# Altium schematic sheet ET-GCLK.SchDoc
size A4
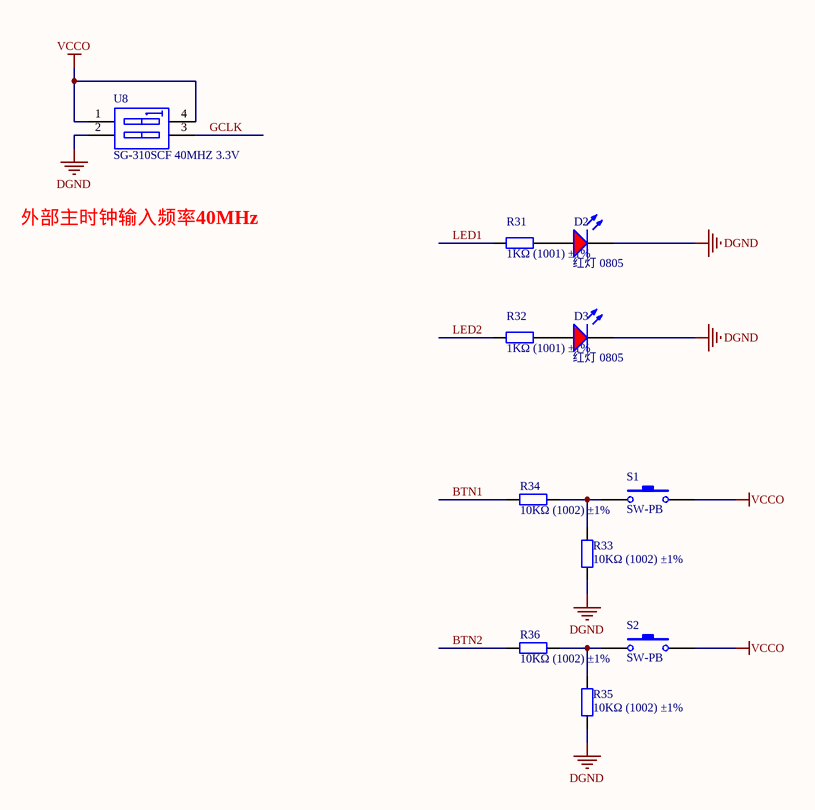
[diagram p0: ET-GCLK.SchDoc]

## Parts
D2  红灯 0805  [LC-0805_LED_S1]
D3  红灯 0805  [LC-0805_LED_S1]
R31  1KΩ (1001) ±1%  [LC-0805_R]
R32  1KΩ (1001) ±1%  [LC-0805_R]
R33  10KΩ (1002) ±1%  [LC-0805_R]
R34  10KΩ (1002) ±1%  [LC-0805_R]
R35  10KΩ (1002) ±1%  [LC-0805_R]
R36  10KΩ (1002) ±1%  [LC-0805_R]
S1  SW-PB  [SPST-2]
S2  SW-PB  [SPST-2]
U8  SG-310SCF 40MHZ 3.3V  [LC-SMD-7050_4P]

## Nets
DGND: D2.K D3.K R33.1 R35.1 U8.2(A2)
VCCO: S1.2 S2.2 U8.1(A1) U8.4(B1)
BTN1: R34.1
BTN2: R36.1
GCLK: U8.3(B2)
LED1: R31.1
LED2: R32.1
NetD2_A: D2.A R31.2
NetD3_A: D3.A R32.2
NetR33_2: R33.2 R34.2 S1.1
NetR35_2: R35.2 R36.2 S2.1

## Notes on the sheet
- 外部主时钟输入频率40MHz

## Library data of the parts
D2 D3 = 0805 红灯: 发光二极管; ComponentLink1Description: 供应商链接; ComponentLink1URL: http://www.szlcsc.com/product/details_2668.html; Package: 0805; Supplier: LC; SuppliersPartNumber: C2295
R31 R32 = 0805 1KΩ (1001) 1%: 贴片电阻; ComponentLink1Description: 供应商链接; ComponentLink1URL: http://www.szlcsc.com/product/details_18201.html; Package: 0805; Supplier: LC; SuppliersPartNumber: C17513
R33-R36 = 0805 10KΩ (1002) 1%: 贴片电阻; ComponentLink1Description: 供应商链接; ComponentLink1URL: http://www.szlcsc.com/product/details_18102.html; Package: 0805; Supplier: LC; SuppliersPartNumber: C17414
S1 S2 = SW-PB: Switch; Published: 24-Mar-1999; LatestRevisionDate: 17-Jul-2002; LatestRevisionNote: Re-released for DXP Platform.; PackageReference: SPST-2; Publisher: Altium Limited; PackageDescription: Switch; 2 Leads
U8 = SW DIP-2: DIP Switch, 2 Position, SPST; Published: 24-Mar-1999; LatestRevisionDate: 17-Jul-2002; LatestRevisionNote: Re-released for DXP Platform.; PackageReference: DIP-4; Publisher: Altium Limited